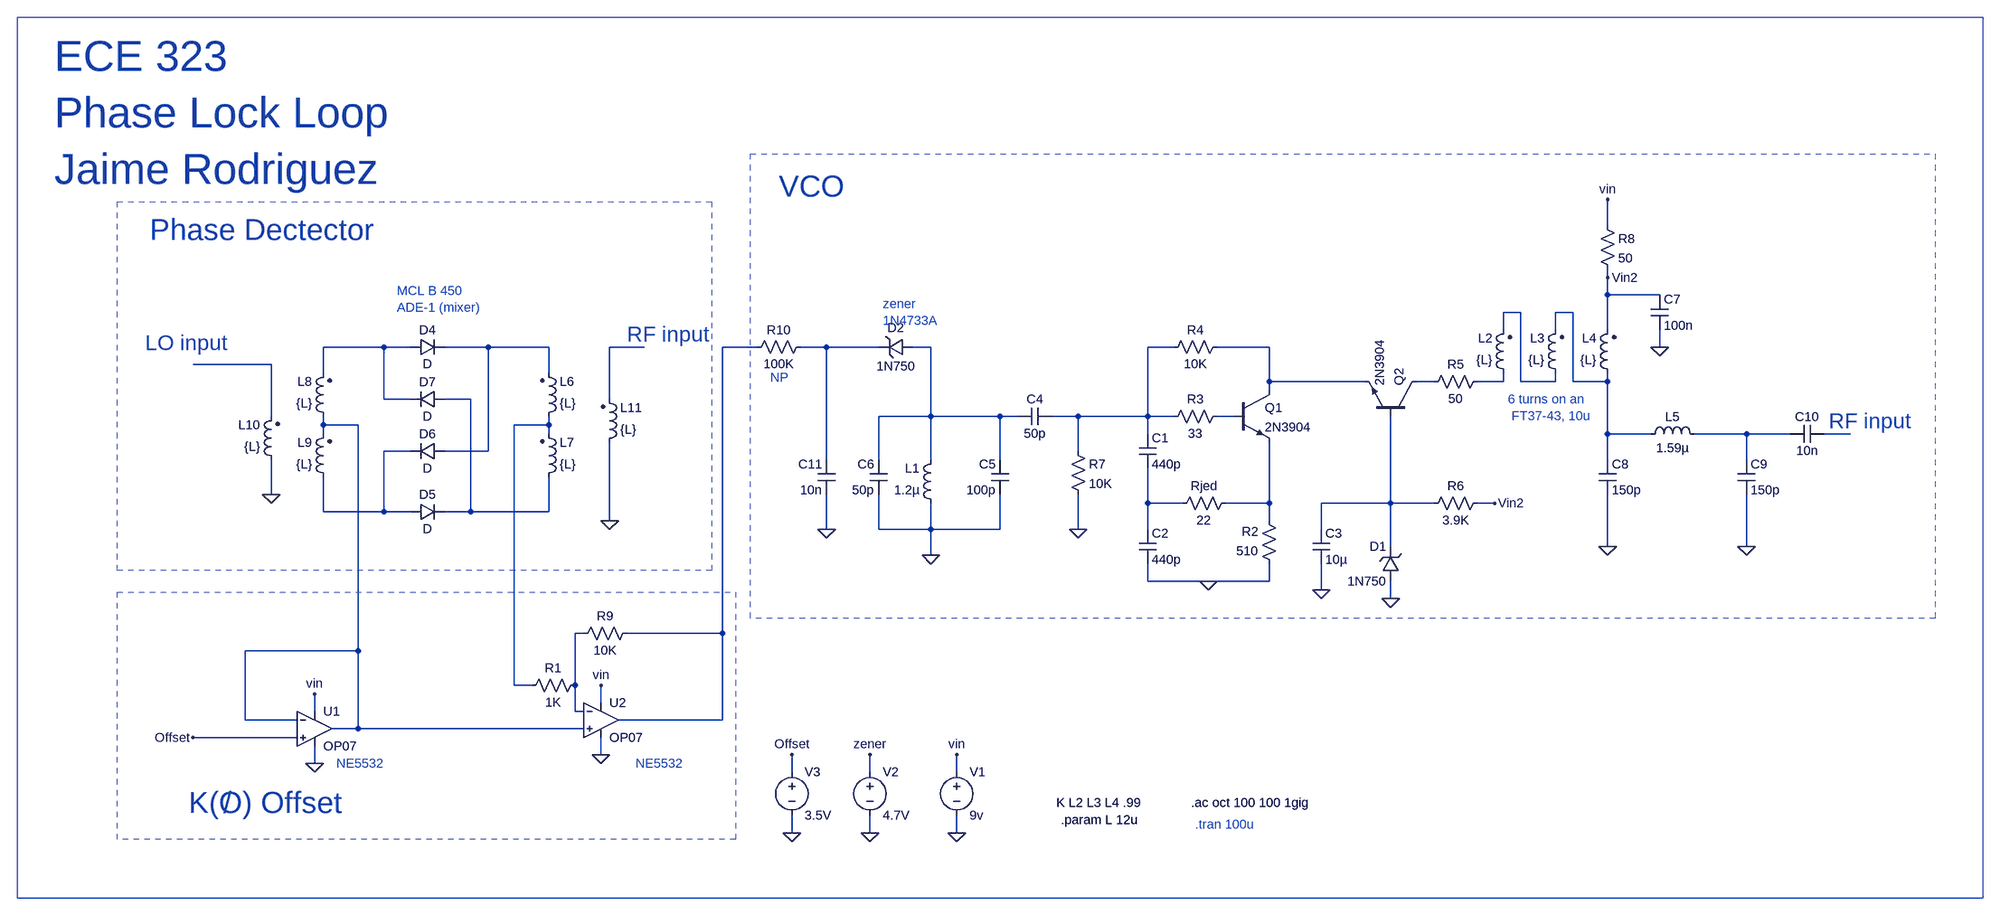
[diagram p0: schematic VCO_Final.asc]
VCO_Final.asc, the LTspice schematic file:
Version 4
SHEET 1 3128 1276
WIRE 992 32 992 -16
WIRE 992 128 992 112
WIRE 992 160 992 128
WIRE 1088 160 992 160
WIRE 832 192 800 192
WIRE 928 192 896 192
WIRE 800 224 800 192
WIRE 896 224 896 192
WIRE 992 224 992 160
WIRE -1264 256 -1376 256
WIRE -1216 256 -1264 256
WIRE -1072 256 -1152 256
WIRE -960 256 -1072 256
WIRE -784 256 -848 256
WIRE -576 256 -640 256
WIRE -448 256 -496 256
WIRE -352 256 -448 256
WIRE -256 256 -288 256
WIRE 192 256 144 256
WIRE 368 256 272 256
WIRE 1088 256 1088 224
WIRE -1472 288 -1616 288
WIRE -1376 304 -1376 256
WIRE -960 304 -960 256
WIRE 368 320 368 256
WIRE 544 320 368 320
WIRE 672 320 640 320
WIRE 800 320 800 304
WIRE 800 320 752 320
WIRE 832 320 832 192
WIRE 896 320 896 304
WIRE 896 320 832 320
WIRE 928 320 928 192
WIRE 992 320 992 304
WIRE 992 320 928 320
WIRE 368 336 368 320
WIRE -1264 352 -1264 256
WIRE -1216 352 -1264 352
WIRE -1104 352 -1152 352
WIRE -848 352 -848 256
WIRE -1472 384 -1472 288
WIRE -256 384 -256 256
WIRE -256 384 -352 384
WIRE -128 384 -256 384
WIRE -96 384 -128 384
WIRE 16 384 -32 384
WIRE 144 384 144 256
WIRE 144 384 16 384
WIRE 192 384 144 384
WIRE 304 384 272 384
WIRE -1376 400 -1376 384
WIRE -1312 400 -1376 400
WIRE -960 400 -960 384
WIRE -960 400 -1024 400
WIRE -1376 416 -1376 400
WIRE -960 416 -960 400
WIRE 144 416 144 384
WIRE 992 416 992 320
WIRE 1072 416 992 416
WIRE 1248 416 1152 416
WIRE 1328 416 1248 416
WIRE 1440 416 1392 416
WIRE -1216 448 -1264 448
WIRE -1072 448 -1072 256
WIRE -1072 448 -1152 448
WIRE 16 448 16 384
WIRE -448 464 -448 256
WIRE -352 464 -352 384
WIRE -256 464 -256 384
WIRE -128 464 -128 384
WIRE 992 464 992 416
WIRE 1248 464 1248 416
WIRE -1472 528 -1472 464
WIRE 144 544 144 480
WIRE 208 544 144 544
WIRE 368 544 368 432
WIRE 368 544 288 544
WIRE 592 544 592 384
WIRE 592 544 464 544
WIRE 672 544 592 544
WIRE 784 544 752 544
WIRE -1376 560 -1376 496
WIRE -1264 560 -1264 448
WIRE -1264 560 -1376 560
WIRE -1216 560 -1264 560
WIRE -1104 560 -1104 352
WIRE -1104 560 -1152 560
WIRE -960 560 -960 496
WIRE -960 560 -1104 560
WIRE -848 576 -848 432
WIRE 368 576 368 544
WIRE -448 592 -448 528
WIRE -352 592 -352 528
WIRE -256 592 -256 544
WIRE -256 592 -352 592
WIRE -128 592 -128 528
WIRE -128 592 -256 592
WIRE 16 592 16 528
WIRE 144 592 144 544
WIRE 464 592 464 544
WIRE 592 624 592 544
WIRE 992 624 992 528
WIRE 1248 624 1248 528
WIRE -256 640 -256 592
WIRE 144 688 144 656
WIRE 256 688 144 688
WIRE 368 688 368 656
WIRE 368 688 256 688
WIRE 464 704 464 656
WIRE 592 720 592 688
WIRE -896 784 -912 784
WIRE -640 784 -640 256
WIRE -640 784 -816 784
WIRE -1312 816 -1312 400
WIRE -1312 816 -1520 816
WIRE -1024 880 -1024 400
WIRE -992 880 -1024 880
WIRE -912 880 -912 784
WIRE -864 912 -864 880
WIRE -1392 928 -1392 896
WIRE -912 928 -912 880
WIRE -896 928 -912 928
WIRE -1520 944 -1520 816
WIRE -1424 944 -1520 944
WIRE -640 944 -640 784
WIRE -640 944 -832 944
WIRE -1312 960 -1312 816
WIRE -1312 960 -1360 960
WIRE -896 960 -1312 960
WIRE -1424 976 -1616 976
WIRE -864 1008 -864 976
WIRE -1392 1024 -1392 992
WIRE -512 1040 -512 1008
WIRE -368 1040 -368 1008
WIRE -208 1040 -208 1008
WIRE -512 1152 -512 1120
WIRE -368 1152 -368 1120
WIRE -208 1152 -208 1120
FLAG -256 640 0
FLAG 256 688 0
FLAG 16 592 0
FLAG 1088 256 0
FLAG 992 128 Vin2
FLAG 784 544 Vin2
FLAG 992 624 0
FLAG 1248 624 0
FLAG -208 1152 0
FLAG -208 1008 vin
FLAG 992 -16 vin
FLAG -368 1152 0
FLAG -368 1008 zener
FLAG 464 704 0
FLAG 592 720 0
FLAG -448 592 0
FLAG -848 576 0
FLAG -1472 528 0
FLAG -1392 1024 0
FLAG -1392 896 vin
FLAG -864 1008 0
FLAG -864 880 vin
FLAG -512 1152 0
FLAG -512 1008 Offset
FLAG -1616 976 Offset
SYMBOL npn 304 336 R0
SYMATTR InstName Q1
SYMATTR Value 2N3904
SYMBOL npn 640 384 M270
SYMATTR InstName Q2
SYMATTR Value 2N3904
SYMBOL cap 128 416 R0
SYMATTR InstName C1
SYMATTR Value 440p
SYMBOL cap 128 592 R0
SYMATTR InstName C2
SYMATTR Value 440p
SYMBOL cap 448 592 R0
SYMATTR InstName C3
SYMATTR Value 10µ
SYMBOL res 304 528 R90
WINDOW 0 0 56 VBottom 2
WINDOW 3 32 56 VTop 2
SYMATTR InstName Rjed
SYMATTR Value 22
SYMBOL res 384 672 R180
WINDOW 0 36 76 Left 2
WINDOW 3 36 40 Left 2
SYMATTR InstName R2
SYMATTR Value 510
SYMBOL res 288 368 R90
WINDOW 0 0 56 VBottom 2
WINDOW 3 32 56 VTop 2
SYMATTR InstName R3
SYMATTR Value 33
SYMBOL res 288 240 R90
WINDOW 0 0 56 VBottom 2
WINDOW 3 32 56 VTop 2
SYMATTR InstName R4
SYMATTR Value 10K
SYMBOL res 768 304 R90
WINDOW 0 0 56 VBottom 2
WINDOW 3 32 56 VTop 2
SYMATTR InstName R5
SYMATTR Value 50
SYMBOL res 768 528 R90
WINDOW 0 0 56 VBottom 2
WINDOW 3 32 56 VTop 2
SYMATTR InstName R6
SYMATTR Value 3.9K
SYMBOL cap -32 368 R90
WINDOW 0 0 32 VBottom 2
WINDOW 3 32 32 VTop 2
SYMATTR InstName C4
SYMATTR Value 50p
SYMBOL cap -112 528 R180
WINDOW 0 24 56 Left 2
WINDOW 3 24 8 Left 2
SYMATTR InstName C5
SYMATTR Value 100p
SYMBOL cap -336 528 R180
WINDOW 0 24 56 Left 2
WINDOW 3 24 8 Left 2
SYMATTR InstName C6
SYMATTR Value 50p
SYMBOL ind -240 560 R180
WINDOW 0 36 80 Left 2
WINDOW 3 36 40 Left 2
SYMATTR InstName L1
SYMATTR Value 1.2µ
SYMBOL res 0 432 R0
SYMATTR InstName R7
SYMATTR Value 10K
SYMBOL ind2 816 320 R180
WINDOW 0 36 80 Left 2
WINDOW 3 36 40 Left 2
SYMATTR InstName L2
SYMATTR Value {L}
SYMATTR Type ind
SYMBOL ind2 912 320 R180
WINDOW 0 36 80 Left 2
WINDOW 3 36 40 Left 2
SYMATTR InstName L3
SYMATTR Value {L}
SYMATTR Type ind
SYMBOL ind2 1008 320 R180
WINDOW 0 36 80 Left 2
WINDOW 3 36 40 Left 2
SYMATTR InstName L4
SYMATTR Value {L}
SYMATTR Type ind
SYMBOL res 976 16 R0
SYMATTR InstName R8
SYMATTR Value 50
SYMBOL cap 1072 160 R0
SYMATTR InstName C7
SYMATTR Value 100n
SYMBOL cap 976 464 R0
SYMATTR InstName C8
SYMATTR Value 150p
SYMBOL cap 1232 464 R0
SYMATTR InstName C9
SYMATTR Value 150p
SYMBOL ind 1056 432 R270
WINDOW 0 32 56 VTop 2
WINDOW 3 5 56 VBottom 2
SYMATTR InstName L5
SYMATTR Value 1.59µ
SYMBOL voltage -208 1024 R0
SYMATTR InstName V1
SYMATTR Value 9v
SYMBOL voltage -368 1024 R0
SYMATTR InstName V2
SYMATTR Value 4.7V
SYMBOL zener 608 688 R180
WINDOW 0 24 64 Left 2
WINDOW 3 24 0 Left 2
SYMATTR InstName D1
SYMATTR Value 1N750
SYMBOL cap 1392 400 R90
WINDOW 0 0 32 VBottom 2
WINDOW 3 32 32 VTop 2
SYMATTR InstName C10
SYMATTR Value 10n
SYMBOL cap -432 464 M0
SYMATTR InstName C11
SYMATTR Value 10n
SYMBOL ind2 -976 400 M180
WINDOW 0 36 80 Left 2
WINDOW 3 36 40 Left 2
SYMATTR InstName L6
SYMATTR Value {L}
SYMATTR Type ind
SYMBOL ind2 -976 512 M180
WINDOW 0 36 80 Left 2
WINDOW 3 36 40 Left 2
SYMATTR InstName L7
SYMATTR Value {L}
SYMATTR Type ind
SYMBOL ind2 -1360 400 R180
WINDOW 0 36 80 Left 2
WINDOW 3 36 40 Left 2
SYMATTR InstName L8
SYMATTR Value {L}
SYMATTR Type ind
SYMBOL ind2 -1360 512 R180
WINDOW 0 36 80 Left 2
WINDOW 3 36 40 Left 2
SYMATTR InstName L9
SYMATTR Value {L}
SYMATTR Type ind
SYMBOL ind2 -1456 480 R180
WINDOW 0 36 80 Left 2
WINDOW 3 36 40 Left 2
SYMATTR InstName L10
SYMATTR Value {L}
SYMATTR Type ind
SYMBOL ind2 -864 448 M180
WINDOW 0 36 80 Left 2
WINDOW 3 36 40 Left 2
SYMATTR InstName L11
SYMATTR Value {L}
SYMATTR Type ind
SYMBOL diode -1216 272 R270
WINDOW 0 32 32 VTop 2
WINDOW 3 0 32 VBottom 2
SYMATTR InstName D4
SYMBOL diode -1216 576 R270
WINDOW 0 32 32 VTop 2
WINDOW 3 0 32 VBottom 2
SYMATTR InstName D5
SYMBOL diode -1152 432 R90
WINDOW 0 0 32 VBottom 2
WINDOW 3 32 32 VTop 2
SYMATTR InstName D6
SYMBOL diode -1152 336 R90
WINDOW 0 0 32 VBottom 2
WINDOW 3 32 32 VTop 2
SYMATTR InstName D7
SYMBOL OP07 -1392 896 R0
SYMATTR InstName U1
SYMBOL OP07 -864 880 R0
SYMATTR InstName U2
SYMBOL res -896 864 R90
WINDOW 0 0 56 VBottom 2
WINDOW 3 32 56 VTop 2
SYMATTR InstName R1
SYMATTR Value 1K
SYMBOL res -800 768 R90
WINDOW 0 0 56 VBottom 2
WINDOW 3 32 56 VTop 2
SYMATTR InstName R9
SYMATTR Value 10K
SYMBOL voltage -512 1024 R0
SYMATTR InstName V3
SYMATTR Value 3.5V
SYMBOL res -480 240 R90
WINDOW 0 0 56 VBottom 2
WINDOW 3 32 56 VTop 2
SYMATTR InstName R10
SYMATTR Value 100K
SYMBOL zener -288 240 R90
WINDOW 0 -4 32 VBottom 2
WINDOW 3 36 32 VTop 2
SYMATTR InstName D2
SYMATTR Value 1N750
TEXT -24 1096 Left 2 !K L2 L3 L4 .99
TEXT -16 1128 Left 2 !.param L 12u
TEXT 232 1136 Left 2 ;.tran 100u
TEXT 224 1096 Left 2 !.ac oct 100 100 1gig
TEXT -1872 -280 Left 6 ;ECE 323 \nPhase Lock Loop\nJaime Rodriguez
TEXT -1696 40 Left 5 ;Phase Dectector
TEXT -536 -40 Left 5 ;VCO
TEXT -1624 1096 Left 5 ;K(O) Offset
TEXT -1560 1096 Left 5 ;/
TEXT -1704 248 Left 4 ;LO input
TEXT -816 232 Left 4 ;RF input
TEXT 1400 392 Left 4 ;RF input
TEXT 808 352 Left 2 ;6 turns on an\n FT37-43, 10u
TEXT -344 176 Left 2 ;zener\n1N4733A
TEXT -1240 152 Left 2 ;MCL B 450\nADE-1 (mixer)
TEXT -1352 1024 Left 2 ;NE5532
TEXT -800 1024 Left 2 ;NE5532
TEXT -552 312 Left 2 ;NP
RECTANGLE Normal -588 -100 1596 756 2
RECTANGLE Normal -1756 -12 -660 668 2
RECTANGLE Normal -1756 708 -616 1164 2
RECTANGLE Normal -1940 -352 1684 1272

The netlist it stands for:
* VCO_Final.asc
Q1 N010 N015 N022 0 2N3904
Q2 N012 N023 N010 0 2N3904
C1 N009 N021 440p
C2 N021 0 440p
C3 N023 0 10µ
Rjed N022 N021 22
R2 0 N022 510
R3 N015 N009 33
R4 N010 N009 10K
R5 N013 N012 50
R6 Vin2 N023 3.9K
C4 N009 N008 50p
C5 0 N008 100p
C6 0 N008 50p
L1 0 N008 1.2µ
R7 N009 0 10K
L2 N013 N001 {L}
L3 N001 N002 {L}
L4 N002 Vin2 {L}
R8 vin Vin2 50
C7 Vin2 0 100n
C8 N002 0 150p
C9 N018 0 150p
L5 N002 N018 1.59µ
V1 vin 0 9v
V2 zener 0 4.7V
D1 0 N023 1N750
C10 N019 N018 10n
C11 N007 0 10n
L6 N017 N004 {L}
L7 N014 N017 {L}
L8 N016 N003 {L}
L9 N020 N016 {L}
L10 0 N011 {L}
L11 0 N005 {L}
D4 N003 N004 D
D5 N020 N014 D
D6 N004 N020 D
D7 N014 N003 D
XU1 Offset N016 vin 0 N016 LT1001  ; OP07, pins In+ In- V+ V- OUT
XU2 N016 N024 vin 0 N006 LT1001  ; OP07, pins In+ In- V+ V- OUT
R1 N024 N017 1K
R9 N006 N024 10K
V3 Offset 0 3.5V
R10 N007 N006 100K
D2 N008 N007 1N750
.model D D
.lib standard.dio
.model NPN NPN
.model PNP PNP
.lib standard.bjt
K L2 L3 L4 .99
.param L 12u
* .tran 100u
.ac oct 100 100 1gig
* ECE 323
* Phase Lock Loop
* Jaime Rodriguez
* Phase Dectector
* VCO
* K(O) Offset
* /
* LO input
* RF input
* RF input
* 6 turns on an
*  FT37-43, 10u
* zener
* 1N4733A
* MCL B 450
* ADE-1 (mixer)
* NE5532
* NE5532
* NP
.lib LTC.lib
.backanno
.end